# Altium project PLWD_Schematics.PrjPcb (part 3 of 3)

## Sheet MCU_GPS_Comms.SchDoc
size A4; SheetNumber: 9; SheetTotal: 9
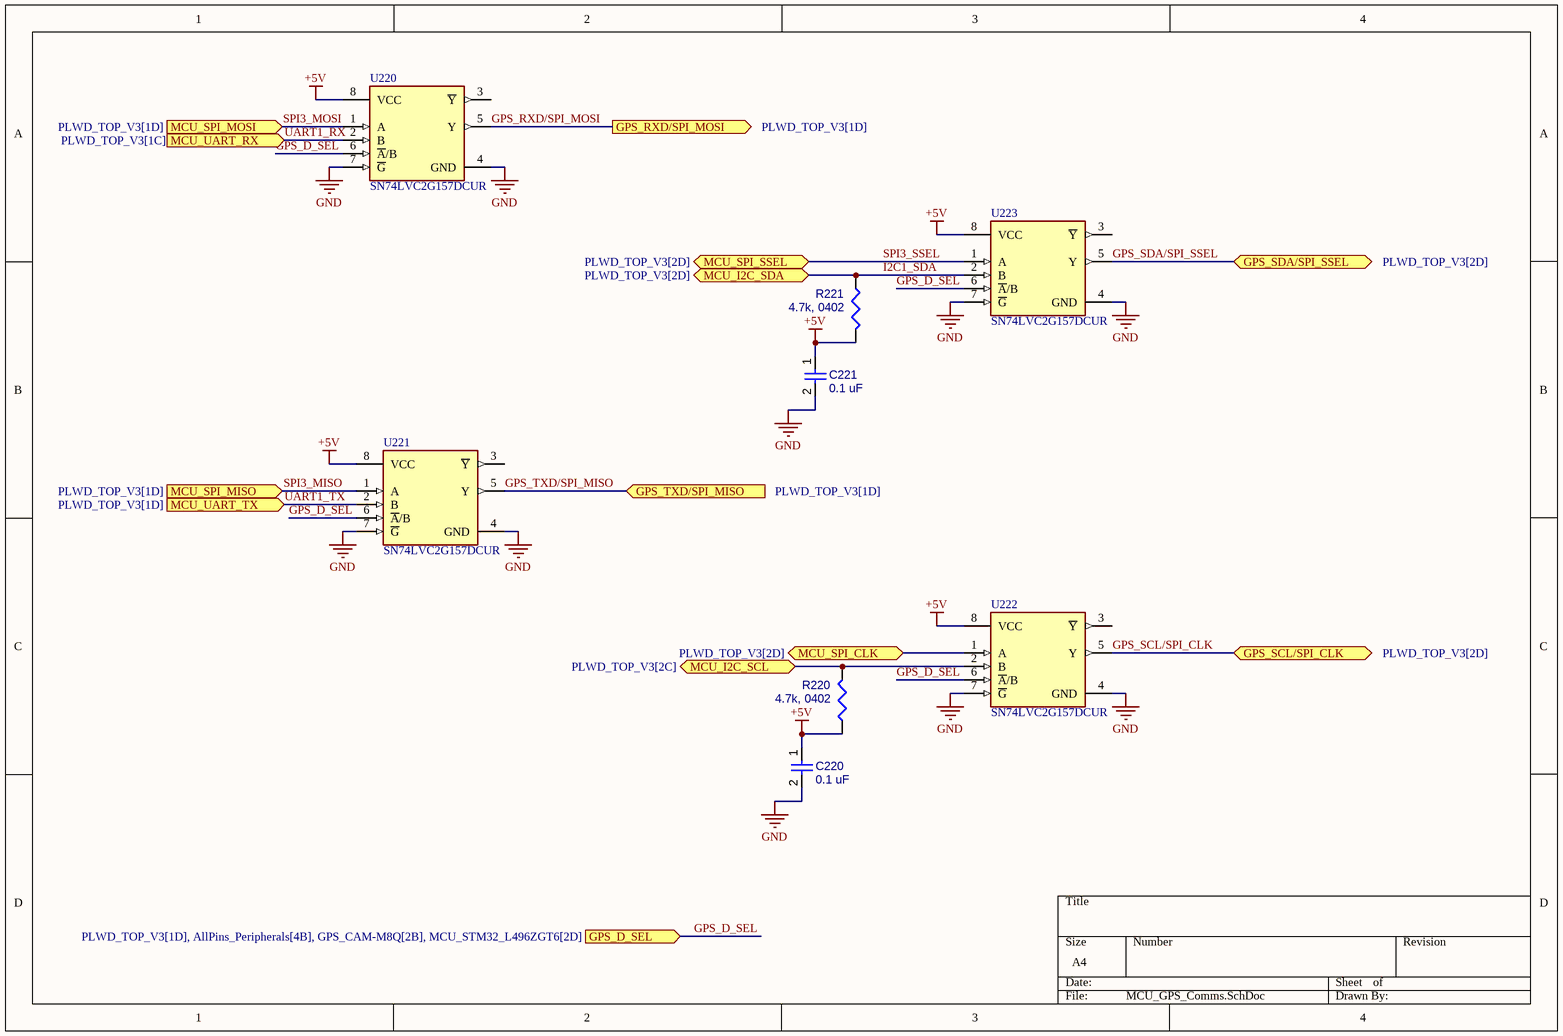
[diagram p8: MCU_GPS_Comms.SchDoc]

### Parts
C220  0.1 uF  [CAPC1005X56X25LL10T15]
C221  0.1 uF  [CAPC1005X56X25LL10T15]
R220  4.7k, 0402  [RESC0402(1005)_L]
R221  4.7k, 0402  [RESC0402(1005)_L]
U220  SN74LVC2G157DCUR  [FP-DCU0008A-MFG]
U221  SN74LVC2G157DCUR  [FP-DCU0008A-MFG]
U222  SN74LVC2G157DCUR  [FP-DCU0008A-MFG]
U223  SN74LVC2G157DCUR  [FP-DCU0008A-MFG]

### Ports
GPS_D_SEL (in, see PLWD_TOP_V3[1D], AllPins_Peripherals[4B], GPS_CAM-M8Q[2B], MCU_STM32_L496ZGT6[2D]), GPS_RXD/SPI_MOSI (out, see PLWD_TOP_V3[1D]), GPS_SCL/SPI_CLK (bidir, see PLWD_TOP_V3[2D]), GPS_SDA/SPI_SSEL (bidir, see PLWD_TOP_V3[2D]), GPS_TXD/SPI_MISO (in, see PLWD_TOP_V3[1D]), MCU_I2C_SCL (bidir, see PLWD_TOP_V3[2C]), MCU_I2C_SDA (bidir, see PLWD_TOP_V3[2D]), MCU_SPI_CLK (bidir, see PLWD_TOP_V3[2D]), MCU_SPI_MISO (in, see PLWD_TOP_V3[1D]), MCU_SPI_MOSI (in, see PLWD_TOP_V3[1D]), MCU_SPI_SSEL (bidir, see PLWD_TOP_V3[2D]), MCU_UART_RX (in, see PLWD_TOP_V3[1C]), MCU_UART_TX (in, see PLWD_TOP_V3[1D])

### Nets
+5V: C220.1 C221.1 R220.1 R221.2 U220.8(VCC) U221.8(VCC) U222.8(VCC) U223.8(VCC)
GND: C220.2 C221.2 U220.4(GND) U220.7(~{G}) U221.4(GND) U221.7(~{G}) U222.4(GND) U222.7(~{G}) U223.4(GND) U223.7(~{G})
GPS_D_SEL: U220.6(~{A}/B) U221.6(~{A}/B) U222.6(~{A}/B) U223.6(~{A}/B) ; port GPS_D_SEL
GPS_RXD/SPI_MOSI: U220.5(Y) ; port GPS_RXD/SPI_MOSI
GPS_SCL/SPI_CLK: U222.5(Y) ; port GPS_SCL/SPI_CLK
GPS_SDA/SPI_SSEL: U223.5(Y) ; port GPS_SDA/SPI_SSEL
GPS_TXD/SPI_MISO: U221.5(Y) ; port GPS_TXD/SPI_MISO
I2C1_SCL: R220.2 U222.2(B) ; port MCU_I2C_SCL
I2C1_SDA: R221.1 U223.2(B) ; port MCU_I2C_SDA
MCU_PG9: U222.1(A) ; port MCU_SPI_CLK
SPI3_MISO: U221.1(A) ; port MCU_SPI_MISO  [project net MCU_PB4]
SPI3_MOSI: U220.1(A) ; port MCU_SPI_MOSI  [project net MCU_PB5]
SPI3_SSEL: U223.1(A) ; port MCU_SPI_SSEL  [project net MCU_PA15]
UART1_RX: U220.2(B) ; port MCU_UART_RX  [project net MCU_PB7]
UART1_TX: U221.2(B) ; port MCU_UART_TX  [project net MCU_PB6]

Not connected (* = marked no-connect by the designer): U220 3(~{Y}); U221 3(~{Y}); U222 3(~{Y}); U223 3(~{Y})

### Library data of the parts
C220 C221 = CMP-001-00001-6: Chip Capacitor, 0.1 uF, +/- 5%, 16 V, 0402 (1005 Metric); Value: 100nF; Capacitor Type: Ceramic; Voltage Rating: 16V; Min Operating Temperature: -55°C; Pins: 2; Case/Package: 0402; Max Operating Temperature: 125°C; Mounting Technology: SM; RoHS Compliant: True; Tolerance: 5%
R220 R221 = CMP-009-00158-3: Chip Resistor, 4,7 kOhms, +/-1 %, 63 mW, -55 to 155 degC, 0402; Power: 63mW; Tolerance: 1%; Max Operating Temperature: 155°C; Pins: 2; Value: 4.7k; Min Operating Temperature: -55°C; Case/Package: 0402
U220-U223 = CMP-0859-00708-4: IC MULTIPLEXER DATA SEL US8; Manufacturer: Texas Instruments; Number Of Outputs: 1; Nominal Supply Current: 10uA; Max Junction Temp: +150°C; Number Of Inputs: 2; Propagation Delay: 4ns; Max Supply Voltage: 5.5V; Standoff Height: 0mm; Frequency: 150MHz; Min Supply Voltage: 1.65V; Ambient Temperature Range Low: -40°C; Device Class L1: Integrated Circuits (ICs); Ambient Temperature Range High: +85°C; Temperature Range High: +85°C; Number Of Circuits: 1; Logic Function Desc: Multiplexer; Package: DCU0008A; ComponentLink2Description: Datasheet; Category: IC; Temperature Range Low: -40°C; Lead Free: Yes; ComponentLink2URL: http://www.ti.com/lit/ds/symlink/sn74lvc2g157.pdf; Device Class L3: Multiplexers; Height: 0.9mm; Automotive: No; Temperature: -40°C to +85°C; Octopart: https://octopart.com/sn74lvc2g157dcur-texas+instruments-472190; RoHS: TRUE; Digikey Description: IC MULTIPLEXER DATA SEL US8; Manufacturer Part Number: SN74LVC2G157DCUR; Device Class L2: Logic ICs; Mouser Description: Single 2-Line to 1-Line Data Selector/Multiplexer 8-VSSOP -40 to 85

## Sheet USB_OTG.SchDoc
size A4; SheetNumber: 10; SheetTotal: 10
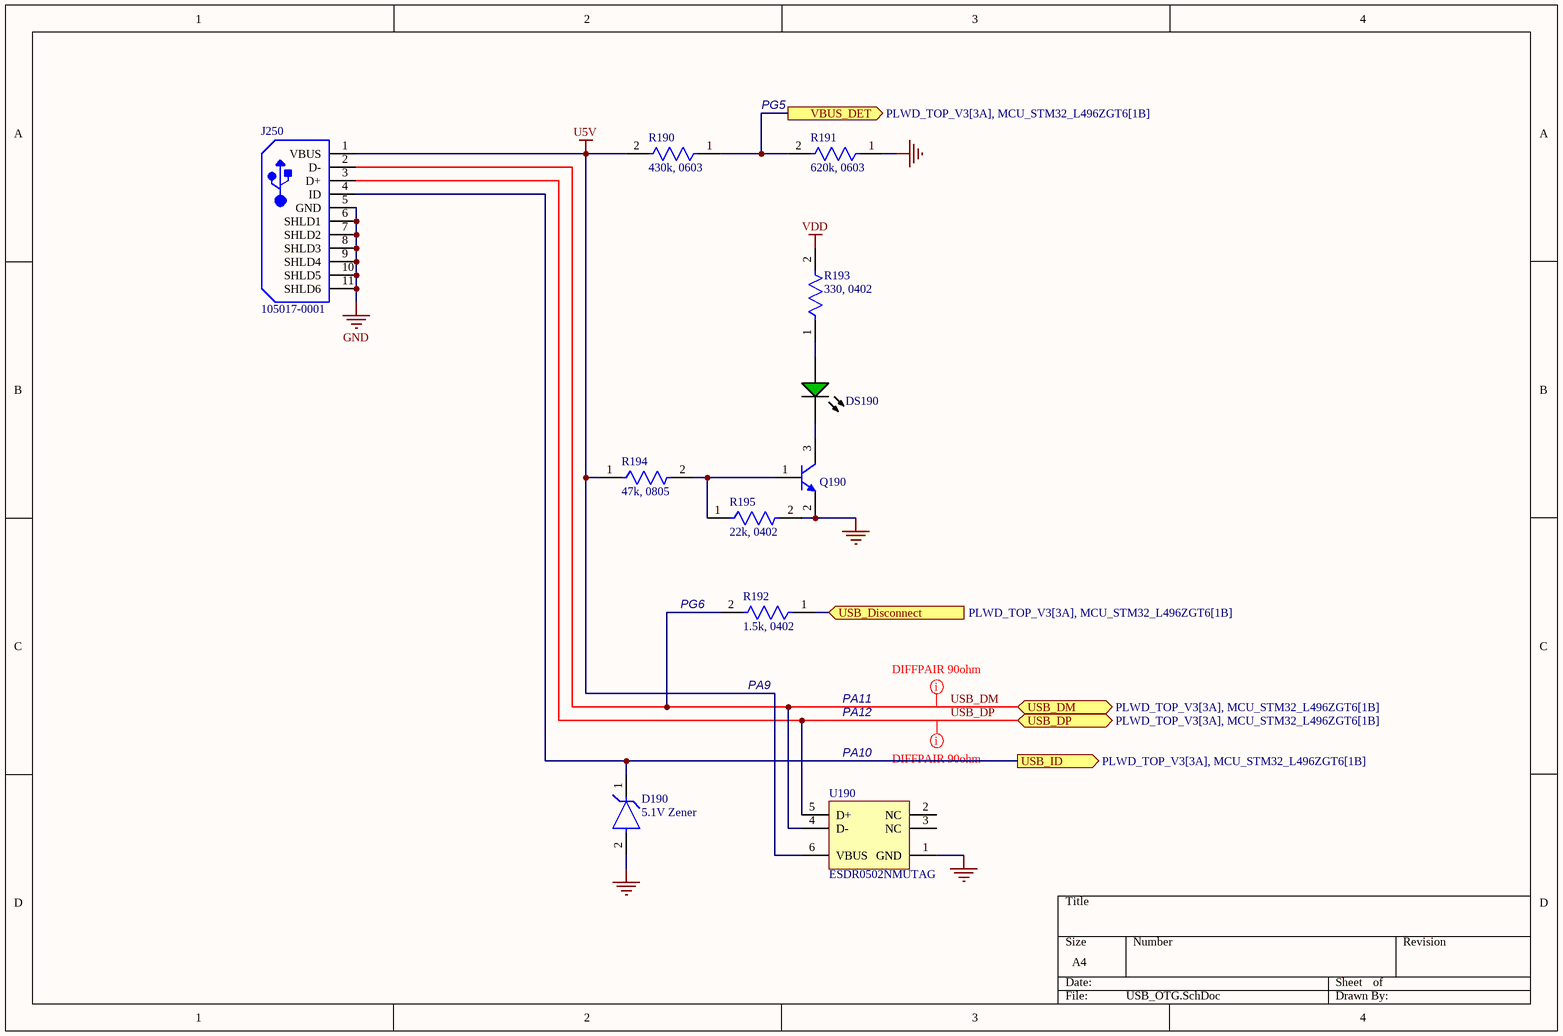
[diagram p9: USB_OTG.SchDoc]

### Parts
D190  5.1V Zener  [FP-SOD123-MFG]
DS190  LTST-C190GKT  [LTST-C190GKT_V]  (value not drawn)
J250  105017-0001  [USB-MICRO-B_V]
Q190  SBC817-40LT3G  [ONSC-SOT-23-3-318-08_V]  (value not drawn)
R190  430k, 0603  [FP-ESR03-IPC_C]
R191  620k, 0603  [FP-CRCW0603-e3-MFG]
R192  1.5k, 0402  [FP-RT0402-MFG]
R193  330, 0402  [FP-RG1005-MFG]
R194  47k, 0805  [FP-CRCW0805-HPe3-IPC_A]
R195  22k, 0402  [FP-RT0402-MFG]
U190  ESDR0502NMUTAG  [ONSC-UDFN-6-517AA-01_V]

### Ports
USB_Disconnect (in, see PLWD_TOP_V3[3A], MCU_STM32_L496ZGT6[1B]), USB_DM (bidir, see PLWD_TOP_V3[3A], MCU_STM32_L496ZGT6[1B]), USB_DP (bidir, see PLWD_TOP_V3[3A], MCU_STM32_L496ZGT6[1B]), USB_ID (out, see PLWD_TOP_V3[3A], MCU_STM32_L496ZGT6[1B]), VBUS_DET (out, see PLWD_TOP_V3[3A], MCU_STM32_L496ZGT6[1B])

### Nets
GND: D190.2(A) J250.5(GND) J250.6(SHLD1) J250.7(SHLD2) J250.8(SHLD3) J250.9(SHLD4) J250.10(SHLD5) J250.11(SHLD6) Q190.2(E) R191.1 R195.2 U190.1(GND)
U5V: J250.1(VBUS) R190.2 R194.1 U190.6(VBUS)
VDD: R193.2  [project net VDD_MCU]
MCU_PA10: D190.1(C) J250.4(ID) ; port USB_ID
MCU_PG5: R190.1 R191.2 ; port VBUS_DET
MCU_PG6: R192.1 ; port USB_Disconnect
USB_DM: J250.2(D-) R192.2 U190.4(D-) ; port USB_DM  [project net MCU_PA11]
USB_DP: J250.3(D+) U190.5(D+) ; port USB_DP  [project net MCU_PA12]
NetDS190_1: DS190.1(A) R193.1
NetDS190_2: DS190.2(K) Q190.3(C)
NetQ190_1: Q190.1(B) R194.2 R195.1

Not connected (* = marked no-connect by the designer): U190 2(NC) 3(NC)

### Layout directives
mark named DIFFPAIR 90ohm: MCU_PA11, MCU_PA12

### Notes on the sheet
- PG5
- (near R192) PG6
- PA9
- PA12
- PA11
- PA10

### Library data of the parts
D190 = CMP-2000-05976-2: DIODE ZENER 5.1V 500MW SOD123; Manufacturer Part Number: BZT52C5V1-7-F; Manufacturer: Diodes Incorporated; Standoff Height: 0mm; Max Reverse Leakage Current: 2uA; Forward Current: 10mA; Power Dissipation: 370mW; Max Zener Voltage: 5.4V; Zener Impedance: 60Ω; Automotive Grade: NA; Max Junction Temp: +150°C; Device Class L3: Zener Diodes; ComponentLink2Description: Datasheet; Mouser Description: Zener Diodes 5.1V 500mW; Octopart: https://octopart.com/bzt52c5v1-7-f-diodes+inc.-326718; Package: SOD123; RoHS: TRUE; Nom Zener Voltage: 5.1V; Device Class L1: Discrete Semiconductors; Lead Free: Yes; Footprint Url: https://www.diodes.com/assets/Package-Files/SOD123.pdf; ComponentLink2URL: https://www.diodes.com/assets/Datasheets/ds18004.pdf; Digikey Description: DIODE ZENER 5.1V 500MW SOD123; Height: 1.45mm; Temperature Range Low: -65°C; Device Class L2: Diodes; Temperature: -65°C to +150°C; Automotive: No; Temperature Range High: +150°C; Category: Diode
DS190 = CMP-007-00022-2: LED Uni-Color Green, 100 mW, 30 mA, -55 to 85 degC, 2-Pin SMD, RoHS, Tape and Reel; Manufacturer: Lite-On; Power: 100mW; Forward Voltage: 2.1V; Viewing Angle: 130degrees; Forward Current: 20mA; Luminous Intensity: 6mcd; Lens Style: Clear; Manufacturer URL: http://www.us.liteon.com/; RoHS Compliant: True; Colour: Green; Package Description: 2-Pin Surface Mount Device, Body 1.6 x 0.8 mm; Datasheet URL: http://datasheet.octopart.com/LTST-C190GKT-Lite-On-datasheet-158530.pdf; Datasheet Version: Dec-06; Mounting Technology: SM; Case/Package: 0603; Package Reference: C190GKT; Packaging: TapeandReel; Min Operating Temperature: -55°C; Nominal Vf: 2.1V; Package Quantity: 3000; Illumination Colour: Green; Max Operating Temperature: 85°C; Pins: 2
J250 = CMP-2000-05827-1: Micro-USB B Receptacle, Right Angle, Bottom Mount, Surface Mount, with Solder Tabs, -30 to 85 degC, 5-Pin USB, RoHS, Tape and Reel; Manufacturer: Molex; Featured Product: Micro-USBConnectorsUSBConnectors; Other Names: WM1399DKR; Package Version: Rev. F, 12/2012; Number of Contacts: 5; Connector Type: USB-microB; Catalog Drawings: 1050170001; 3D Model: 105017-0001.stp; Mating Products: WM17145-ND-CABLEMICROUSBBTOSTDA1.0MWM17147-ND-CABLEMICROUSBBTOSTDA2.0MWM17146-ND-CABLEMICROUSBBTOSTDA1.5M; PCN Assembly/Origin: ResinSupplier21/Oct/2015; Voltage - Max: 30V; Online Catalog: Molex-MicroUSB; Manufacturer URL: http://www.molex.com/; Package Description: 5-Leads USB, Micro B, Body 7.5 x 5 mm, Pitch 0.65 mm; Datasheet URL: http://www.molex.com/elqNow/elqRedir.htm?ref=http://www.molex.com/webdocs/datasheets/pdf/en-us/1050170001_IO_CONNECTORS.pdf; Ingress Protection: -; Datasheet Version: 03/2016; Mounting Type: BoardCutout,SurfaceMount,RightAngle; Circuits: 5; Standard Package: 1; Package Reference: MICRO-B; Package URL: http://www.molex.com/pdm_docs/sd/1050170001_sd.pdf; Category: Connectors,Interconnects; Series: -; RoHS Information: 1050170001CertofCompliance; Features: Shielded,SolderRetention; Family: USB,DVI,HDMIConnectors; Specifications: -; Gender: Receptacle; Packaging: Digi-Reel®; Mounting Technology: SurfaceMount
Q190 = CMP-1048-00776-1: General Purpose Transistor, NPN Silicon, 3-Pin SOT-23, Pb-Free, Tape and Reel; Manufacturer: On Semiconductor; fT Min (MHz): 100; IC Continuous (A): 0.5; ComponentLink2URL: http://www.onsemi.com/pub_link/Collateral/BC817-16LT1-D.PDF; ComponentLink1Description: Manufacturer URL; Polarity: NPN; PackageDescription: 3-Pin Small Outline Transistor, Body 2.92 x 1.3 mm, Pitch 0.95 mm; ComponentLink2Description: Datasheet; PackageVersion: Rev. AP, 11/2009; Packing: Tape and Reel; RoHS: TRUE; ComponentLink3URL: http://www.onsemi.cn/pub_link/Collateral/318-08.PDF; PartNumber: SBC817-40LT3G; PackageReference: SOT-23-3-318-08; ComponentLink1URL: http://www.onsemi.com/; ComponentLink3Description: Package Specification; Mounting Technology: Surface Mount; DatasheetVersion: Rev. 12
R190 = CMP-08839-027977-1: 430kΩ ±5% 0.25W 0603 Anti-Surge Chip Resistor AEC-Q200; Temperature Coefficient: 200ppm/°C; Resistance: 430kR; Max Power Dissipation: 250mW; Length: 0.063inch; Case/Package: 0603; Number of Terminations: 2; Package Quantity: 5000; Series: ESR; Width: 0.031inch; Case Code (Imperial): 0603; Tolerance: 5%; Height: 0.022inch; Resistor Type: Thick Film; Packaging: Cut Tape; Min Operating Temperature: -55°C; Case Code (Metric): 1608; RoHS Compliant: Yes; Max Operating Temperature: 155°C; Features: Automotive AEC-Q200
R191 = CMP-2000-03512-2: RES Thick Film, 620kΩ, 5%, 0.1W, 200ppm/°C, 0603; Voltage Rating: 75V; Power Rating: 100mW; Resistance: 620kR; Tolerance: 5%; Military Standard: Not; Radiation Hardening: No; Lead Free: Lead Free; Contact Plating: Tin; Weight: 7.1E-05oz; Max Operating Temperature: 155°C; Case Code (Imperial): 0603; Voltage Rating (DC): 75V; Composition: Thick Film; Temperature Coefficient: 200ppm/°C; Height: 0.02inch; Min Operating Temperature: -55°C; Features: Automotive AEC-Q200; Width: 0.033inch; Max Power Dissipation: 100mW; Package Quantity: 1; Depth: 0.85mm; Length: 1.55mm; Packaging: Tape and Reel; Number of Terminations: 2; Case Code (Metric): 1608; Case/Package: 0603
R192 = CMP-03412-012409-1: RT0402DRE071K5L     RES SMD 1.5K OHM 0.5% 1/16W 0402; Manufacturer: Yageo; Power Rating: 0.063W; Temperature Coefficient: 50 ppm/°C; Resistance: 1.5KΩ; Voltage Rating: 50V; Value: 1.5KΩ; Tolerance: 0.005; Automotive: No; Composition: Thin Film; Device Class L2: Resistors; Footprint Url: http://www.yageo.com/exep/pages/download/literatures/PYu-R_Mount_10.pdf; Category: Res; RoHS: TRUE; Digikey Description: RES SMD 1.5K OHM 0.5% 1/16W 0402; Temperature Range Low: -55°C; Octopart: https://octopart.com/rt0402dre071k5l-yageo-1450177; Temperature Range High: +155°C; Device Class L3: Chip SMD Resistors; Temperature: -55°C to +155°C; Manufacturer Part Number: RT0402DRE071K5L; Ipc Land Pattern Name: RESC10050X30; Lead Free: Yes; Device Class L1: Passive Components; Series: RT; Height: 0.35mm; ComponentLink2Description: Datasheet; ComponentLink2URL: http://www.yageo.com/documents/recent/PYu-RT_1-to-0.01_RoHS_L_9.pdf; Package: RT0402
R193 = CMP-28537-007483-1: RG1005P-331-B-T5 / Automotive Metal Thin Film Chip Resistor, 0402, 330Ω, 0.1%, 25ppm/°C, 0.0625W, 75V; Power Rating: 63mW; Voltage Rating (DC): 25V; Resistance: 330R; Lead Free: Lead Free; Case Code (Metric): 1005; Width: 0.02inch; Tolerance: 0.1%; Max Power Dissipation: 63mW; Number of Terminations: 2; Resistor Type: Thin Film; Min Operating Temperature: -55°C; Package Quantity: 1; Resistance Tolerance: 0.1%; Case/Package: 0402; Voltage Rating: 75V; Length: 0.039inch; Height: 0.016inch; Max Operating Temperature: 155°C; Number of Pins: 2; Features: Automotive AEC-Q200; Series: RG; Weight: 2.3E-05oz; Termination: SMD/SMT; Case Code (Imperial): 0402; RoHS Compliant: Yes; Temperature Coefficient: 25ppm/°C; Packaging: Tape and Reel
R194 = CMP-02407-008731-1: RES Thick Film, 47kΩ, 1%, 0.5W, 100ppm/°C, 0805; Resistance: 47kR; Voltage Rating (DC): 150V; Max Power Dissipation: 333mW; Power Rating: 330mW; Case Code (Metric): 2012; Width: 1.2mm; Packaging: Cut Tape; Temperature Coefficient: 100ppm/°C; Number of Terminations: 2; Tolerance: 1%; Voltage Rating: 150V; Length: 2mm; Termination: SMD/SMT; Contact Plating: Tin; Lead Free: Lead Free; Package Quantity: 10; Mount: Surface Mount; Min Operating Temperature: -55°C; Composition: Thick Film; Case/Package: 0805; Max Operating Temperature: 155°C; Features: Automotive AEC-Q200; Depth: 1.25mm; Height: 0.024inch; Case Code (Imperial): 0805; Weight: 0.000194oz
R195 = CMP-2002-02617-2: RES SMD 22K OHM 0.1% 1/16W 0402; Manufacturer: Yageo; Manufacturer Part Number: RT0402BRD0722KL; Value: 22KΩ; Power Rating: 0.063W; Voltage Rating: 50V; Tolerance: 0.001; Temperature Coefficient: 25 ppm/°C; Package: RT0402; RoHS: TRUE; ComponentLink2Description: Datasheet; Octopart: https://octopart.com/rt0402brd0722kl-yageo-1219504; ComponentLink2URL: http://www.yageo.com/documents/recent/PYu-RT_1-to-0.01_RoHS_L_9.pdf; Composition: Thin Film; Temperature: -55°C to +155°C; Lead Free: Yes; Ipc Land Pattern Name: RESC10050X30; Temperature Range High: +155°C; Height: 0.35mm; Resistance: 22KΩ; Device Class L2: Resistors; Temperature Range Low: -55°C; Device Class L1: Passive Components; Digikey Description: RES SMD 22K OHM 0.1% 1/16W 0402; Automotive: No; Series: RT; Footprint Url: http://www.yageo.com/exep/pages/download/literatures/PYu-R_Mount_10.pdf; Category: Res; Device Class L3: Chip SMD Resistors; Mouser Description: Res Thin Film 0402 22K Ohm 0.1% 1/16W ±25ppm/°C Molded SMD SMD Paper T/R
U190 = CMP-1063-00250-1: Ultra Low Capacitance ESD Protection Array for High Speed Data Line Protection, 6-Pin UDFN, Pb-Free, Tape and Reel; Manufacturer: On Semiconductor; C Max (pF): 0.6; PPK Max (W): 100; V(BR) Min (V): 6; IR Max (uA): 1; Number of Lines: 4; VRWM Max (V): 5.5; Direction: Unidirectional; ComponentLink2URL: http://www.onsemi.cn/pub_link/Collateral/ESDR0502N-D.PDF; PackageDescription: 6-Pin Small Outline No-Lead, Body 1.2 x 1 mm, Pitch 0.4 mm; DatasheetVersion: Rev. 4; Packing: Tape and Reel; ComponentLink3URL: http://www.onsemi.com/pub_link/Collateral/517AA.PDF; PackageReference: UDFN-6-517AA-01; ComponentLink1Description: Manufacturer URL; ComponentLink2Description: Datasheet; ComponentLink3Description: Package Specification; PackageVersion: Rev. D, 09/2010; ComponentLink1URL: http://www.onsemi.com/; PartNumber: ESDR0502NMUTAG; RoHS: Pb-Free; Mounting Technology: Surface Mount

## Nets that join several sheets
+5V: PowerSupply (6 pins), MCU_GPS_Comms (8 pins)
AGND: MCU_STM32_L496ZGT6 (8 pins), LTE_SARA-R422-00B (ANT1.2), AllPins_MCU (J403.2)
GND: MCU_STM32_L496ZGT6 (31 pins), LTE_SARA-R422-00B (77 pins), GPS_CAM-M8Q (23 pins), BLE_ESP32-WROOM-32 (8 pins), PowerSupply (32 pins), AllPins_MCU (J401.16 J402.18 J403.15), MCU_GPS_Comms (10 pins), USB_OTG (12 pins)
U5V: MCU_STM32_L496ZGT6 (R100.1), PowerSupply (6 pins), USB_OTG (J250.1 R190.2 R194.1 U190.6)
VDD_MCU: MCU_STM32_L496ZGT6 (28 pins), LTE_SARA-R422-00B (8 pins), GPS_CAM-M8Q (7 pins), BLE_ESP32-WROOM-32 (5 pins), PowerSupply (7 pins), AllPins_MCU (J401.15 J402.7 J402.17 J403.14), USB_OTG (R193.2)
VDDA_MCU: MCU_STM32_L496ZGT6 (7 pins), AllPins_MCU (J403.1)
1V8: LTE_SARA-R422-00B (MD160.4), AllPins_Peripherals (J309.1)
~{BM_ALCC}: MCU_STM32_L496ZGT6 (U100.9), PowerSupply (U180.6), AllPins_Peripherals (P314.3)
BLE_EN: MCU_STM32_L496ZGT6 (U100.43), BLE_ESP32-WROOM-32 (R120.1 R123.1), AllPins_Peripherals (P300.1)
BLE_IO0: MCU_STM32_L496ZGT6 (U100.37), BLE_ESP32-WROOM-32 (MD120.25), AllPins_Peripherals (P305.3)
BLE_IO2: MCU_STM32_L496ZGT6 (U100.40), BLE_ESP32-WROOM-32 (MD120.24), AllPins_Peripherals (P302.4)
BLE_IO4: BLE_ESP32-WROOM-32 (MD120.26), AllPins_Peripherals (P305.2)
BLE_IO5: MCU_STM32_L496ZGT6 (U100.36), BLE_ESP32-WROOM-32 (MD120.29), AllPins_Peripherals (J304.4)
BLE_IO12/MTDI: MCU_STM32_L496ZGT6 (U100.42), BLE_ESP32-WROOM-32 (MD120.14), AllPins_Peripherals (P300.12)
BLE_IO13: BLE_ESP32-WROOM-32 (MD120.16), AllPins_Peripherals (J301.1)
BLE_IO14: BLE_ESP32-WROOM-32 (MD120.13), AllPins_Peripherals (P300.11)
BLE_IO15_MTDO: MCU_STM32_L496ZGT6 (U100.41), BLE_ESP32-WROOM-32 (MD120.23), AllPins_Peripherals (P302.3)
BLE_IO16: BLE_ESP32-WROOM-32 (MD120.27), AllPins_Peripherals (P305.1)
BLE_IO17: BLE_ESP32-WROOM-32 (MD120.28), AllPins_Peripherals (J304.5)
BLE_IO18: BLE_ESP32-WROOM-32 (MD120.30), AllPins_Peripherals (J304.3)
BLE_IO19: BLE_ESP32-WROOM-32 (MD120.31), AllPins_Peripherals (J304.2)
BLE_IO21: BLE_ESP32-WROOM-32 (MD120.33), AllPins_Peripherals (J304.1)
BLE_IO22: BLE_ESP32-WROOM-32 (MD120.36), AllPins_Peripherals (P303.3)
BLE_IO23: BLE_ESP32-WROOM-32 (MD120.37), AllPins_Peripherals (P303.4)
BLE_IO25: BLE_ESP32-WROOM-32 (MD120.10), AllPins_Peripherals (P300.8)
BLE_IO26: BLE_ESP32-WROOM-32 (MD120.11), AllPins_Peripherals (P300.9)
BLE_IO27: BLE_ESP32-WROOM-32 (MD120.12), AllPins_Peripherals (P300.10)
BLE_IO32: BLE_ESP32-WROOM-32 (MD120.8), AllPins_Peripherals (P300.6)
BLE_IO33: BLE_ESP32-WROOM-32 (MD120.9), AllPins_Peripherals (P300.7)
BLE_IO34: BLE_ESP32-WROOM-32 (MD120.6), AllPins_Peripherals (P300.4)
BLE_IO35: BLE_ESP32-WROOM-32 (MD120.7), AllPins_Peripherals (P300.5)
BLE_RXD0: MCU_STM32_L496ZGT6 (U100.34), BLE_ESP32-WROOM-32 (MD120.34 R121.1), AllPins_Peripherals (P303.1)
BLE_SCK/CLK: BLE_ESP32-WROOM-32 (MD120.20), AllPins_Peripherals (J301.5)
BLE_SCS/CMD: BLE_ESP32-WROOM-32 (MD120.19), AllPins_Peripherals (J301.4)
BLE_SDI/SD1: BLE_ESP32-WROOM-32 (MD120.22), AllPins_Peripherals (P302.2)
BLE_SDO/SD0: BLE_ESP32-WROOM-32 (MD120.21), AllPins_Peripherals (P302.1)
BLE_SENSOR_VN: BLE_ESP32-WROOM-32 (MD120.5), AllPins_Peripherals (P300.3)
BLE_SENSOR_VP: BLE_ESP32-WROOM-32 (MD120.4), AllPins_Peripherals (P300.2)
BLE_SHD/SD2: BLE_ESP32-WROOM-32 (MD120.17), AllPins_Peripherals (J301.2)
BLE_SWP/SD3: BLE_ESP32-WROOM-32 (MD120.18), AllPins_Peripherals (J301.3)
BLE_TXD0: MCU_STM32_L496ZGT6 (U100.35), BLE_ESP32-WROOM-32 (MD120.35 R122.1), AllPins_Peripherals (P303.2)
BM_SCL: MCU_STM32_L496ZGT6 (U100.11), PowerSupply (R181.1 U180.4), AllPins_Peripherals (P314.1)
BM_SDA: MCU_STM32_L496ZGT6 (U100.10), PowerSupply (R182.1 U180.5), AllPins_Peripherals (P314.2)
~{GPS_EN}: MCU_STM32_L496ZGT6 (U100.109), GPS_CAM-M8Q (5 pins)
~{GPS_RESET}: MCU_STM32_L496ZGT6 (U100.114), GPS_CAM-M8Q (R140.2), AllPins_Peripherals (J306.2)
~{GPS_SBT}: MCU_STM32_L496ZGT6 (U100.113), GPS_CAM-M8Q (R149.2), AllPins_Peripherals (J306.3)
GPS_D_SEL: MCU_STM32_L496ZGT6 (U100.115), GPS_CAM-M8Q (R142.2), AllPins_Peripherals (J306.1), MCU_GPS_Comms (U220.6 U221.6 U222.6 U223.6)
GPS_EXTINT: MCU_STM32_L496ZGT6 (U100.105), GPS_CAM-M8Q (R141.2), AllPins_Peripherals (P307.1)
GPS_LNA_EN: GPS_CAM-M8Q (R143.2 R154.1 U142.6), AllPins_Peripherals (P308.1)
GPS_RXD/SPI_MOSI: GPS_CAM-M8Q (R145.2), AllPins_Peripherals (J306.5), MCU_GPS_Comms (U220.5)
GPS_SCL/SPI_CLK: GPS_CAM-M8Q (R146.2), AllPins_Peripherals (P307.2), MCU_GPS_Comms (U222.5)
GPS_SDA/SPI_SSEL: GPS_CAM-M8Q (R147.2), AllPins_Peripherals (P307.3), MCU_GPS_Comms (U223.5)
GPS_TIMEPULSE: MCU_STM32_L496ZGT6 (U100.112), GPS_CAM-M8Q (R144.2), AllPins_Peripherals (P308.2)
GPS_TXD/SPI_MISO: GPS_CAM-M8Q (R148.2), AllPins_Peripherals (J306.4), MCU_GPS_Comms (U221.5)
I2C1_SCL: MCU_STM32_L496ZGT6 (U100.129), MCU_GPS_Comms (R220.2 U222.2)
I2C1_SDA: MCU_STM32_L496ZGT6 (U100.128), MCU_GPS_Comms (R221.1 U223.2)
IMC_ANT: LTE_SARA-R422-00B (C165.2 MD160.56), AllPins_Peripherals (P313.1)
IMP_ANT_DET: LTE_SARA-R422-00B (MD160.62 R164.2), AllPins_Peripherals (P313.2)
LTE_CTS: MCU_STM32_L496ZGT6 (U100.80), LTE_SARA-R422-00B (MD160.11), AllPins_Peripherals (P310.2)
LTE_DCD: LTE_SARA-R422-00B (MD160.8), AllPins_Peripherals (J309.4)
LTE_DSR: LTE_SARA-R422-00B (MD160.6), AllPins_Peripherals (J309.2)
LTE_DTR: LTE_SARA-R422-00B (MD160.9), AllPins_Peripherals (J309.5)
LTE_GPIO1: LTE_SARA-R422-00B (MD160.16), AllPins_Peripherals (P310.6)
LTE_GPIO2: LTE_SARA-R422-00B (MD160.23), AllPins_Peripherals (P311.1)
LTE_GPIO3: LTE_SARA-R422-00B (MD160.24), AllPins_Peripherals (P311.2)
LTE_GPIO4: LTE_SARA-R422-00B (MD160.25), AllPins_Peripherals (P311.3)
LTE_GPIO5/SIM_DETECT: LTE_SARA-R422-00B (MD160.42), AllPins_Peripherals (P312.1)
LTE_GPIO6: LTE_SARA-R422-00B (MD160.19), AllPins_Peripherals (P310.8)
LTE_I2S_CLK: LTE_SARA-R422-00B (MD160.36), AllPins_Peripherals (P312.7)
LTE_I2S_RXD: LTE_SARA-R422-00B (MD160.37), AllPins_Peripherals (P312.6)
LTE_I2S_TXD: LTE_SARA-R422-00B (MD160.35), AllPins_Peripherals (P312.8)
LTE_I2S_WA: LTE_SARA-R422-00B (MD160.34), AllPins_Peripherals (P311.8)
LTE_PWR_CTRL: LTE_SARA-R422-00B (MD160.15 U160.4), AllPins_Peripherals (P310.5)
LTE_RI: LTE_SARA-R422-00B (MD160.7), AllPins_Peripherals (J309.3)
LTE_RTS: MCU_STM32_L496ZGT6 (U100.81), LTE_SARA-R422-00B (MD160.10), AllPins_Peripherals (P310.1)
LTE_RXD: MCU_STM32_L496ZGT6 (U100.78), LTE_SARA-R422-00B (MD160.13 R165.1), AllPins_Peripherals (P310.4)
LTE_SCL: LTE_SARA-R422-00B (MD160.27), AllPins_Peripherals (P311.5)
LTE_SDA: LTE_SARA-R422-00B (MD160.26), AllPins_Peripherals (P311.4)
LTE_SIM_CLK: LTE_SARA-R422-00B (C161.2 D162.2 J170.C3 MD160.38), AllPins_Peripherals (P312.5)
LTE_SIM_IO: LTE_SARA-R422-00B (C162.2 D163.2 J170.C7 MD160.39), AllPins_Peripherals (P312.4)
LTE_SIM_RST: LTE_SARA-R422-00B (C160.2 D161.2 J170.C2 MD160.40), AllPins_Peripherals (P312.3)
LTE_TXD: MCU_STM32_L496ZGT6 (U100.77), LTE_SARA-R422-00B (MD160.12), AllPins_Peripherals (P310.3)
LTE_USB_5V0: LTE_SARA-R422-00B (MD160.17), AllPins_Peripherals (P310.7)
LTE_USB_D+: LTE_SARA-R422-00B (J162.3 MD160.29), AllPins_Peripherals (P311.7)
LTE_USB_D-: LTE_SARA-R422-00B (J162.2 MD160.28), AllPins_Peripherals (P311.6)
LTE_VSIM: LTE_SARA-R422-00B (5 pins), AllPins_Peripherals (P312.2)
MCU_LTE_PWR_CTRL: MCU_STM32_L496ZGT6 (U100.74), LTE_SARA-R422-00B (U160.5)
MCU_PA8: MCU_STM32_L496ZGT6 (U100.100), AllPins_MCU (J401.22)
MCU_PA9: MCU_STM32_L496ZGT6 (R100.2 R101.2 U100.101), AllPins_MCU (J401.21)
MCU_PA10: MCU_STM32_L496ZGT6 (U100.102), AllPins_MCU (J401.24), USB_OTG (D190.1 J250.4)
MCU_PA11: MCU_STM32_L496ZGT6 (U100.103), AllPins_MCU (J401.23), USB_OTG (J250.2 R192.2 U190.4)
MCU_PA12: MCU_STM32_L496ZGT6 (U100.104), AllPins_MCU (J401.26), USB_OTG (J250.3 U190.5)
MCU_PA15: MCU_STM32_L496ZGT6 (U100.110), MCU_GPS_Comms (U223.1)
MCU_PB0: MCU_STM32_L496ZGT6 (U100.46), AllPins_MCU (J402.4)
MCU_PB1: MCU_STM32_L496ZGT6 (U100.47), AllPins_MCU (J402.3)
MCU_PB2: MCU_STM32_L496ZGT6 (U100.48), AllPins_MCU (J402.6)
MCU_PB3: MCU_STM32_L496ZGT6 (U100.133), AllPins_MCU (J400.12)
MCU_PB4: MCU_STM32_L496ZGT6 (U100.134), MCU_GPS_Comms (U221.1)
MCU_PB5: MCU_STM32_L496ZGT6 (U100.135), MCU_GPS_Comms (U220.1)
MCU_PB6: MCU_STM32_L496ZGT6 (U100.136), MCU_GPS_Comms (U221.2)
MCU_PB7: MCU_STM32_L496ZGT6 (U100.137), MCU_GPS_Comms (U220.2)
MCU_PB8: MCU_STM32_L496ZGT6 (U100.139), AllPins_MCU (J400.14)
MCU_PB9: MCU_STM32_L496ZGT6 (U100.140), AllPins_MCU (J400.13)
MCU_PB10: MCU_STM32_L496ZGT6 (U100.69), AllPins_MCU (J402.26)
MCU_PB11: MCU_STM32_L496ZGT6 (U100.70), AllPins_MCU (J402.25)
MCU_PB12: MCU_STM32_L496ZGT6 (U100.73), AllPins_MCU (J401.2)
MCU_PB14: MCU_STM32_L496ZGT6 (U100.75), AllPins_MCU (J401.1)
MCU_PB15: MCU_STM32_L496ZGT6 (U100.76), AllPins_MCU (J401.4)
MCU_PC0: MCU_STM32_L496ZGT6 (U100.26), AllPins_MCU (J403.6)
MCU_PC1: MCU_STM32_L496ZGT6 (U100.27), AllPins_MCU (J403.5)
MCU_PC2: MCU_STM32_L496ZGT6 (U100.28), AllPins_MCU (J403.4)
MCU_PC3: MCU_STM32_L496ZGT6 (U100.29), AllPins_MCU (J403.3)
MCU_PC4: MCU_STM32_L496ZGT6 (U100.44), AllPins_MCU (J402.2)
MCU_PC5: MCU_STM32_L496ZGT6 (U100.45), AllPins_MCU (J402.1)
MCU_PC6: MCU_STM32_L496ZGT6 (U100.96), AllPins_MCU (J401.18)
MCU_PC7: MCU_STM32_L496ZGT6 (U100.97), AllPins_MCU (J401.17)
MCU_PC8: MCU_STM32_L496ZGT6 (U100.98), AllPins_MCU (J401.20)
MCU_PC9: MCU_STM32_L496ZGT6 (U100.99), AllPins_MCU (J401.19)
MCU_PC10: MCU_STM32_L496ZGT6 (U100.111), AllPins_MCU (J401.25)
MCU_PC13: MCU_STM32_L496ZGT6 (U100.7), AllPins_MCU (J403.21)
MCU_PC14: MCU_STM32_L496ZGT6 (U100.8), AllPins_MCU (J403.20)
MCU_PD2: MCU_STM32_L496ZGT6 (U100.116), AllPins_MCU (J400.2)
MCU_PD3: MCU_STM32_L496ZGT6 (U100.117), AllPins_MCU (J400.1)
MCU_PD4: MCU_STM32_L496ZGT6 (U100.118), AllPins_MCU (J400.4)
MCU_PD5: MCU_STM32_L496ZGT6 (U100.119), AllPins_MCU (J400.3)
MCU_PD6: MCU_STM32_L496ZGT6 (U100.122), AllPins_MCU (J400.6)
MCU_PD7: MCU_STM32_L496ZGT6 (U100.123), AllPins_MCU (J400.5)
MCU_PD10: MCU_STM32_L496ZGT6 (U100.79), AllPins_MCU (J401.3)
MCU_PD13: MCU_STM32_L496ZGT6 (U100.82), AllPins_MCU (J401.6)
MCU_PD14: MCU_STM32_L496ZGT6 (U100.85), AllPins_MCU (J401.5)
MCU_PD15: MCU_STM32_L496ZGT6 (U100.86), AllPins_MCU (J401.8)
MCU_PE0: MCU_STM32_L496ZGT6 (U100.141), AllPins_MCU (J400.16)
MCU_PE1: MCU_STM32_L496ZGT6 (U100.142), AllPins_MCU (J400.15)
MCU_PE2: MCU_STM32_L496ZGT6 (U100.1), AllPins_MCU (J403.26)
MCU_PE3: MCU_STM32_L496ZGT6 (U100.2), AllPins_MCU (J403.25)
MCU_PE4: MCU_STM32_L496ZGT6 (U100.3), AllPins_MCU (J403.24)
MCU_PE5: MCU_STM32_L496ZGT6 (U100.4), AllPins_MCU (J403.23)
MCU_PE6: MCU_STM32_L496ZGT6 (U100.5), AllPins_MCU (J403.22)
MCU_PE7: MCU_STM32_L496ZGT6 (U100.58), AllPins_MCU (J402.13)
MCU_PE8: MCU_STM32_L496ZGT6 (U100.59), AllPins_MCU (J402.16)
MCU_PE9: MCU_STM32_L496ZGT6 (U100.60), AllPins_MCU (J402.15)
MCU_PE10: MCU_STM32_L496ZGT6 (U100.63), AllPins_MCU (J402.20)
MCU_PE11: MCU_STM32_L496ZGT6 (U100.64), AllPins_MCU (J402.19)
MCU_PE12: MCU_STM32_L496ZGT6 (U100.65), AllPins_MCU (J402.22)
MCU_PE13: MCU_STM32_L496ZGT6 (U100.66), AllPins_MCU (J402.21)
MCU_PE14: MCU_STM32_L496ZGT6 (U100.67), AllPins_MCU (J402.24)
MCU_PE15: MCU_STM32_L496ZGT6 (U100.68), AllPins_MCU (J402.23)
MCU_PF2: MCU_STM32_L496ZGT6 (U100.12), AllPins_MCU (J403.19)
MCU_PF3: MCU_STM32_L496ZGT6 (U100.13), AllPins_MCU (J403.18)
MCU_PF4: MCU_STM32_L496ZGT6 (U100.14), AllPins_MCU (J403.17)
MCU_PF5: MCU_STM32_L496ZGT6 (U100.15), AllPins_MCU (J403.16)
MCU_PF6: MCU_STM32_L496ZGT6 (U100.18), AllPins_MCU (J403.13)
MCU_PF7: MCU_STM32_L496ZGT6 (U100.19), AllPins_MCU (J403.12)
MCU_PF8: MCU_STM32_L496ZGT6 (U100.20), AllPins_MCU (J403.11)
MCU_PF9: MCU_STM32_L496ZGT6 (U100.21), AllPins_MCU (J403.10)
MCU_PF10: MCU_STM32_L496ZGT6 (U100.22), AllPins_MCU (J403.9)
MCU_PF11: MCU_STM32_L496ZGT6 (U100.49), AllPins_MCU (J402.5)
MCU_PF12: MCU_STM32_L496ZGT6 (U100.50), AllPins_MCU (J402.8)
MCU_PF13: MCU_STM32_L496ZGT6 (U100.53), AllPins_MCU (J402.10)
MCU_PF14: MCU_STM32_L496ZGT6 (U100.54), AllPins_MCU (J402.9)
MCU_PF15: MCU_STM32_L496ZGT6 (U100.55), AllPins_MCU (J402.12)
MCU_PG0: MCU_STM32_L496ZGT6 (U100.56), AllPins_MCU (J402.11)
MCU_PG1: MCU_STM32_L496ZGT6 (U100.57), AllPins_MCU (J402.14)
MCU_PG2: MCU_STM32_L496ZGT6 (U100.87), AllPins_MCU (J401.7)
MCU_PG3: MCU_STM32_L496ZGT6 (U100.88), AllPins_MCU (J401.10)
MCU_PG4: MCU_STM32_L496ZGT6 (U100.89), AllPins_MCU (J401.9)
MCU_PG5: MCU_STM32_L496ZGT6 (U100.90), AllPins_MCU (J401.12), USB_OTG (R190.1 R191.2)
MCU_PG6: MCU_STM32_L496ZGT6 (U100.91), AllPins_MCU (J401.11), USB_OTG (R192.1)
MCU_PG7: MCU_STM32_L496ZGT6 (U100.92), AllPins_MCU (J401.14)
MCU_PG8: MCU_STM32_L496ZGT6 (U100.93), AllPins_MCU (J401.13)
MCU_PG9: MCU_STM32_L496ZGT6 (U100.124), MCU_GPS_Comms (U222.1)
MCU_PG10: MCU_STM32_L496ZGT6 (U100.125), AllPins_MCU (J400.8)
MCU_PG11: MCU_STM32_L496ZGT6 (U100.126), AllPins_MCU (J400.7)
MCU_PG12: MCU_STM32_L496ZGT6 (U100.127), AllPins_MCU (J400.10)
MCU_PG15: MCU_STM32_L496ZGT6 (U100.132), AllPins_MCU (J400.9)
MCU_PH0: MCU_STM32_L496ZGT6 (U100.23), AllPins_MCU (J403.8)
MCU_PH1: MCU_STM32_L496ZGT6 (U100.24), AllPins_MCU (J403.7)
MCU_PH3-BOOT0: MCU_STM32_L496ZGT6 (U100.138), AllPins_MCU (J400.11)